# EAGLE schematic Codeshelf-0009.v01 (EAGLE 6.5.0)
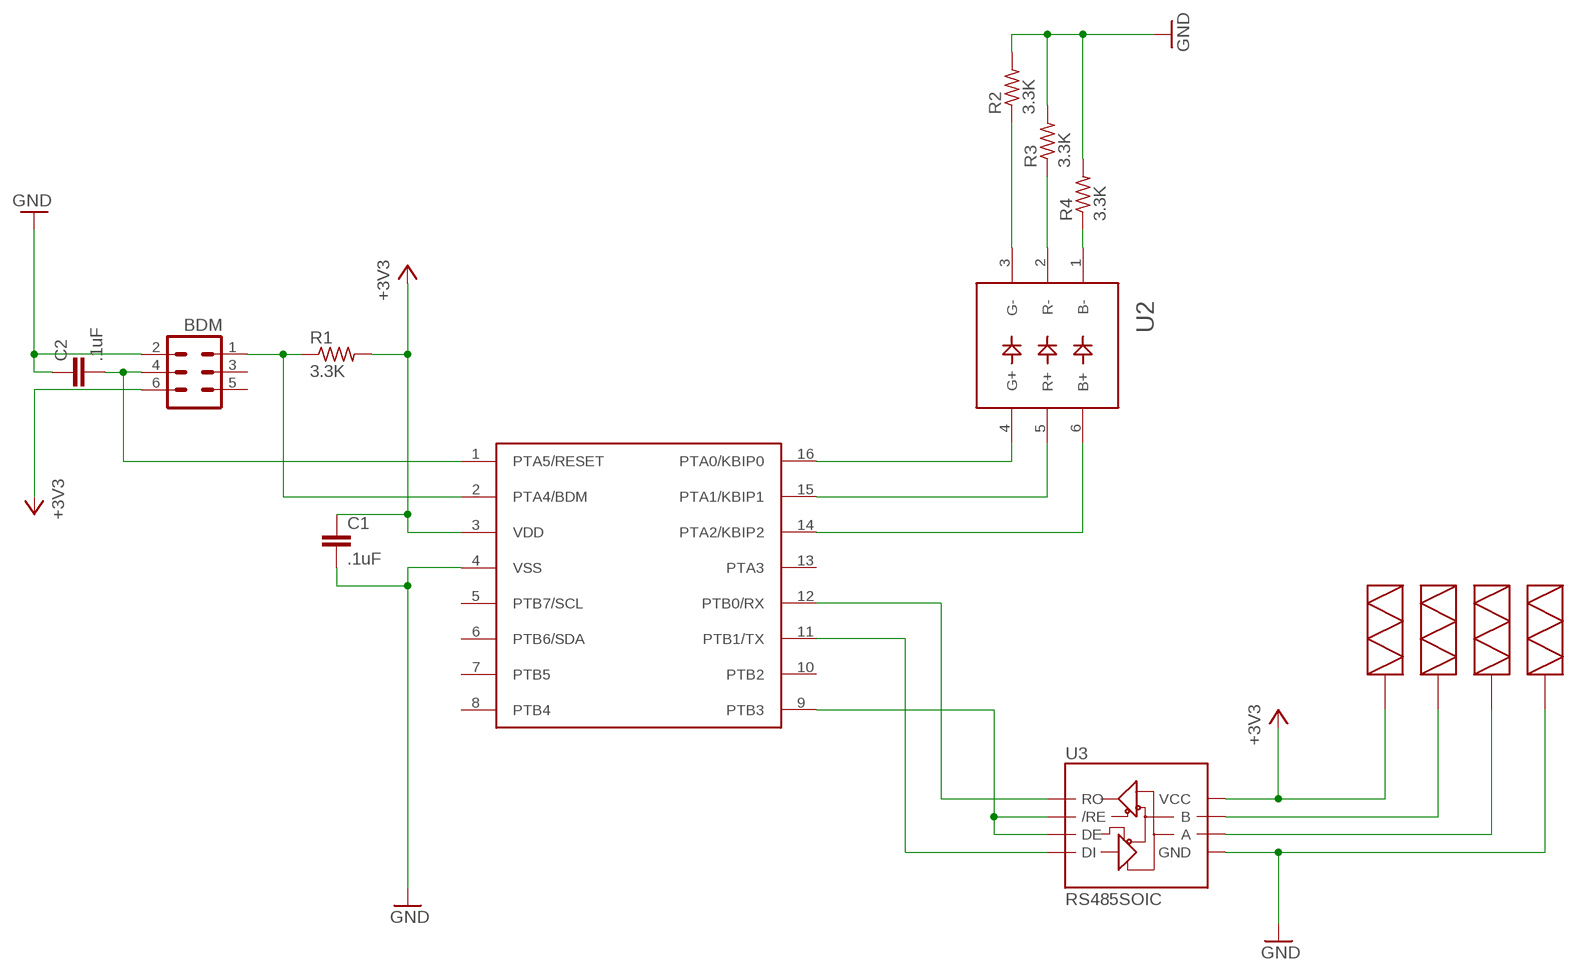
[diagram p0: schematic, sheet 1]

## Parts
BDM  HEADER-3X2  [HEADER-3X2]
C1  .1uF  RF-C0402  [C0402]
C2  .1uF  RF-C0402  [C0402]
J1  CONTACT-SPRING-S7071-42R  CONTACT-SPRING-S1761  [CONTACT-SPRING-S1761]
J2  CONTACT-SPRING-S7071-42R  CONTACT-SPRING-S1761  [CONTACT-SPRING-S1761]
J3  CONTACT-SPRING-S7071-42R  CONTACT-SPRING-S1761  [CONTACT-SPRING-S1761]
J4  CONTACT-SPRING-S7071-42R  CONTACT-SPRING-S1761  [CONTACT-SPRING-S1761]
R1  3.3K  RF-R0402  [RF-R0402]
R2  3.3K  RF-R0402  [RF-R0402]
R3  3.3K  RF-R0402  [RF-R0402]
R4  3.3K  RF-R0402  [RF-R0402]
U1  MC9S08QG-DT  [TSSOP16]
U2  LED5060A  [PLCC-6]
U3  RS485SOIC  [SO08]

## Nets
+3V3 [+3V3]: BDM.6 C1.1 J1.P1 R1.2 U1.3(VDD) U3.8(VCC)
A: J3.P1 U3.6(A)
B: J2.P1 U3.7(B)
GND [GND]: BDM.2 C1.2 C2.1 J4.P1 R2.2 R3.2 R4.2 U1.4(VSS) U3.5(GND)
N$1: R2.1 U2.3(G-)
N$3: R3.1 U2.2(R-)
N$4: R4.1 U2.1(B-)
N$5: U1.16(PTA0/KBIP0) U2.4(G+)
N$6: U1.15(PTA1/KBIP1) U2.5(R+)
N$7: U1.14(PTA2/KBIP2) U2.6(B+)
N$9: BDM.1 R1.1 U1.2(PTA4/BDM)
N$19: U1.9(PTB3) U3.2(/RE) U3.3(DE)
N$23: BDM.4 C2.2 U1.1(PTA5/RESET)
RX: U1.12(PTB0/RX) U3.1(RO)
TX: U1.11(PTB1/TX) U3.4(DI)
Unconnected: BDM.3 BDM.5 U1.5(PTB7/SCL) U1.6(PTB6/SDA) U1.7(PTB5) U1.8(PTB4) U1.10(PTB2) U1.13(PTA3)

## Library data of the parts
BDM = GW-devices:HEADER-3X2
C1 C2 = GW-devices:RF-C: RF capacitor pads for FSL reference design; MFGN: Murata; MFGP: GRM033R61A104KE15D; PRICE: 0.02
J1-J4 = GW-devices:CONTACT-SPRING; MFGN: Harwin; MFGP: S1761-46R; PRICE: 0.39
R1-R4 = GW-devices:RF-R: RF resistor pads for FSL reference design; MFGN: Panasonic; MFGP: ERJ-2GEJ332X; PRICE: 0.02
U1 = GW-devices:MC9S08QG; MFGN: Freescale; MFGP: MC9S08QG8CDTER; PRICE: 1.73
U2 = GW-devices:LED5060: PLCC-6 5060 6000mcd RGB LED; PRICE: 0.25
U3 = SparkFun:RS485; MFGN: TI; MFGP: SN65HVD1781DR; PRICE: 4.29

## Net classes
1 +3V3: width 0.3 mm
2 GND: width 0.3 mm